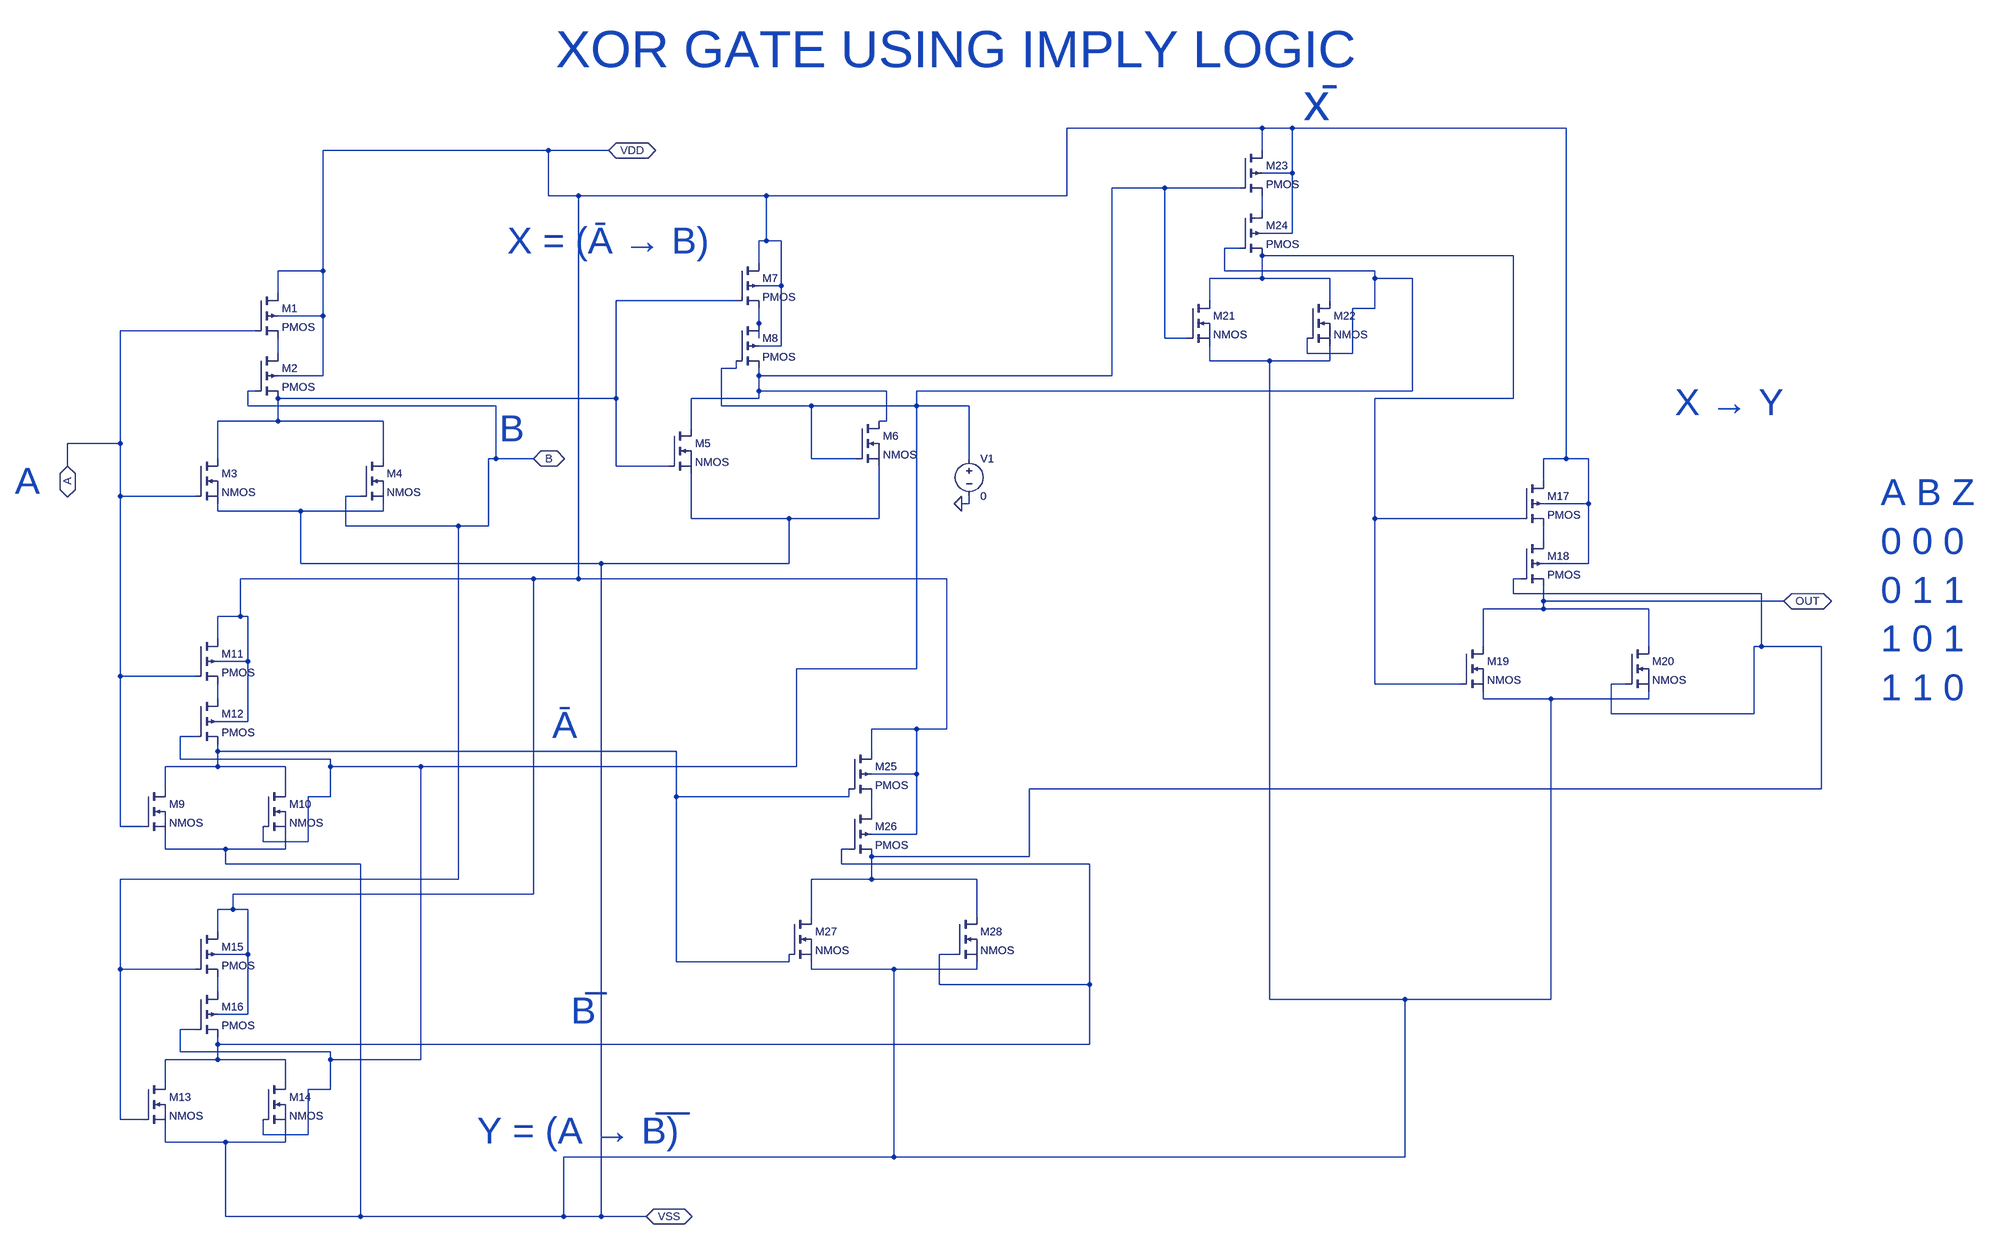
[diagram p0: schematic Xorimply.asc]
Xorimply.asc, the LTspice schematic file:
Version 4
SHEET 1 2252 1368
WIRE 672 -1056 256 -1056
WIRE 736 -1056 672 -1056
WIRE 1344 -1056 736 -1056
WIRE -848 -1008 -1328 -1008
WIRE -720 -1008 -848 -1008
WIRE 672 -1008 672 -1056
WIRE 736 -960 736 -1056
WIRE 736 -960 672 -960
WIRE 464 -928 352 -928
WIRE 624 -928 464 -928
WIRE -848 -912 -848 -1008
WIRE -784 -912 -848 -912
WIRE -384 -912 -784 -912
WIRE 256 -912 256 -1056
WIRE 256 -912 -384 -912
WIRE 672 -880 672 -912
WIRE 736 -832 736 -960
WIRE 736 -832 672 -832
WIRE -384 -816 -384 -912
WIRE -384 -816 -400 -816
WIRE -352 -816 -384 -816
WIRE 624 -800 592 -800
WIRE 1232 -784 672 -784
WIRE -400 -768 -400 -816
WIRE -1328 -752 -1328 -1008
WIRE -1328 -752 -1424 -752
WIRE 592 -752 592 -800
WIRE 912 -752 592 -752
WIRE 672 -736 672 -784
WIRE 672 -736 560 -736
WIRE 816 -736 672 -736
WIRE 912 -736 912 -752
WIRE 992 -736 912 -736
WIRE -352 -720 -352 -816
WIRE -352 -720 -400 -720
WIRE -1424 -704 -1424 -752
WIRE -448 -688 -704 -688
WIRE 560 -688 560 -736
WIRE 816 -688 816 -736
WIRE 912 -672 912 -736
WIRE 912 -672 864 -672
WIRE -1328 -656 -1328 -752
WIRE -1328 -656 -1424 -656
WIRE -400 -640 -400 -672
WIRE -1472 -624 -1760 -624
WIRE -400 -608 -400 -640
WIRE 464 -608 464 -928
WIRE 512 -608 464 -608
WIRE -352 -592 -352 -720
WIRE -352 -592 -400 -592
WIRE -1424 -576 -1424 -608
WIRE 768 -576 768 -608
WIRE 864 -576 864 -672
WIRE 864 -576 768 -576
WIRE 560 -560 560 -592
WIRE 688 -560 560 -560
WIRE 816 -560 816 -592
WIRE 816 -560 688 -560
WIRE -448 -544 -448 -560
WIRE -448 -544 -480 -544
WIRE -1328 -528 -1328 -656
WIRE -1328 -528 -1424 -528
WIRE -400 -528 -400 -544
WIRE 352 -528 352 -928
WIRE 352 -528 -400 -528
WIRE -1472 -496 -1488 -496
WIRE -400 -496 -400 -528
WIRE -128 -496 -400 -496
WIRE 992 -496 992 -736
WIRE 992 -496 -64 -496
WIRE -704 -480 -704 -688
WIRE -704 -480 -1424 -480
WIRE -400 -480 -400 -496
WIRE -400 -480 -544 -480
WIRE 1232 -480 1232 -784
WIRE 1232 -480 912 -480
WIRE -1488 -464 -1488 -496
WIRE -960 -464 -1488 -464
WIRE -480 -464 -480 -544
WIRE -288 -464 -480 -464
WIRE -64 -464 -64 -496
WIRE -64 -464 -288 -464
WIRE 48 -464 -64 -464
WIRE -1424 -432 -1424 -480
WIRE -1424 -432 -1552 -432
WIRE -1200 -432 -1424 -432
WIRE -128 -432 -128 -496
WIRE -128 -432 -144 -432
WIRE -544 -416 -544 -480
WIRE -1760 -384 -1760 -624
WIRE -1760 -384 -1872 -384
WIRE -1552 -352 -1552 -432
WIRE -1200 -352 -1200 -432
WIRE -960 -352 -960 -464
WIRE -960 -352 -976 -352
WIRE -880 -352 -960 -352
WIRE -288 -352 -288 -464
WIRE -192 -352 -288 -352
WIRE 48 -352 48 -464
WIRE 1344 -352 1344 -1056
WIRE 1344 -352 1296 -352
WIRE 1392 -352 1344 -352
WIRE -1872 -336 -1872 -384
WIRE -704 -336 -704 -480
WIRE -592 -336 -704 -336
WIRE 1296 -304 1296 -352
WIRE -1760 -272 -1760 -384
WIRE -1600 -272 -1760 -272
WIRE -1248 -272 -1280 -272
WIRE 48 -256 48 -272
WIRE 48 -256 32 -256
WIRE 1392 -256 1392 -352
WIRE 1392 -256 1296 -256
WIRE -1552 -240 -1552 -256
WIRE -1376 -240 -1552 -240
WIRE -1200 -240 -1200 -256
WIRE -1200 -240 -1376 -240
WIRE -544 -224 -544 -320
WIRE -336 -224 -544 -224
WIRE -144 -224 -144 -336
WIRE -144 -224 -336 -224
WIRE 912 -224 912 -480
WIRE 1248 -224 912 -224
WIRE -1280 -208 -1280 -272
WIRE -1040 -208 -1280 -208
WIRE -976 -208 -976 -352
WIRE -976 -208 -1040 -208
WIRE 1296 -176 1296 -208
WIRE -1376 -128 -1376 -240
WIRE -736 -128 -1376 -128
WIRE -336 -128 -336 -224
WIRE -336 -128 -736 -128
WIRE 1392 -128 1392 -256
WIRE 1392 -128 1296 -128
WIRE -880 -96 -1504 -96
WIRE -784 -96 -784 -912
WIRE -784 -96 -880 -96
WIRE 0 -96 -784 -96
WIRE 1248 -96 1232 -96
WIRE 1232 -64 1232 -96
WIRE 1760 -64 1232 -64
WIRE 1296 -48 1296 -80
WIRE 1808 -48 1296 -48
WIRE 1296 -32 1296 -48
WIRE 1296 -32 1168 -32
WIRE 1520 -32 1296 -32
WIRE -1504 -16 -1504 -96
WIRE -1504 -16 -1552 -16
WIRE -1488 -16 -1504 -16
WIRE -1552 32 -1552 -16
WIRE 1168 48 1168 -32
WIRE 1520 48 1520 -32
WIRE 1760 48 1760 -64
WIRE 1760 48 1744 48
WIRE 1888 48 1760 48
WIRE -1488 80 -1488 -16
WIRE -1488 80 -1552 80
WIRE -64 96 -64 -464
WIRE -64 96 -320 96
WIRE -1760 112 -1760 -272
WIRE -1600 112 -1760 112
WIRE 912 128 912 -224
WIRE 1120 128 912 128
WIRE 1472 128 1440 128
WIRE -1552 160 -1552 128
WIRE 1168 160 1168 144
WIRE 1312 160 1168 160
WIRE 1520 160 1520 144
WIRE 1520 160 1312 160
WIRE 1440 192 1440 128
WIRE 1744 192 1744 48
WIRE 1744 192 1440 192
WIRE -1488 208 -1488 80
WIRE -1488 208 -1552 208
WIRE -64 224 -160 224
WIRE 0 224 0 -96
WIRE 0 224 -64 224
WIRE -1600 240 -1632 240
WIRE -1552 272 -1552 256
WIRE -576 272 -1552 272
WIRE -160 272 -160 224
WIRE -1632 288 -1632 240
WIRE -1312 288 -1632 288
WIRE -1552 304 -1552 272
WIRE -1552 304 -1664 304
WIRE -1408 304 -1552 304
WIRE -1312 304 -1312 288
WIRE -1120 304 -1312 304
WIRE -320 304 -320 96
WIRE -320 304 -1120 304
WIRE -64 320 -64 224
WIRE -64 320 -160 320
WIRE -1664 352 -1664 304
WIRE -1408 352 -1408 304
WIRE 1888 352 1888 48
WIRE 1888 352 176 352
WIRE -1312 368 -1312 304
WIRE -1312 368 -1360 368
WIRE -576 368 -576 272
WIRE -208 368 -208 352
WIRE -208 368 -576 368
WIRE -160 400 -160 368
WIRE -1760 432 -1760 112
WIRE -1712 432 -1760 432
WIRE -64 448 -64 320
WIRE -64 448 -160 448
WIRE -1456 464 -1456 432
WIRE -1360 464 -1360 368
WIRE -1360 464 -1456 464
WIRE -1664 480 -1664 448
WIRE -1536 480 -1664 480
WIRE -1408 480 -1408 448
WIRE -1408 480 -1536 480
WIRE -208 480 -224 480
WIRE 176 496 176 352
WIRE 176 496 -160 496
WIRE -1536 512 -1536 480
WIRE -1248 512 -1536 512
WIRE -224 512 -224 480
WIRE 304 512 -224 512
WIRE -1040 544 -1040 -208
WIRE -1040 544 -1760 544
WIRE -160 544 -160 496
WIRE -160 544 -288 544
WIRE 64 544 -160 544
WIRE -880 576 -880 -96
WIRE -880 576 -1520 576
WIRE -1520 608 -1520 576
WIRE -1520 608 -1552 608
WIRE -1488 608 -1520 608
WIRE -288 624 -288 544
WIRE 64 624 64 544
WIRE -1552 656 -1552 608
WIRE -1488 704 -1488 608
WIRE -1488 704 -1552 704
WIRE 16 704 -16 704
WIRE -576 720 -576 368
WIRE -336 720 -336 704
WIRE -336 720 -576 720
WIRE -1760 736 -1760 544
WIRE -1600 736 -1760 736
WIRE -288 736 -288 720
WIRE -112 736 -288 736
WIRE 64 736 64 720
WIRE 64 736 -112 736
WIRE -16 768 -16 704
WIRE 304 768 304 512
WIRE 304 768 -16 768
WIRE -1552 784 -1552 752
WIRE 688 800 688 -560
WIRE 976 800 688 800
WIRE 1312 800 1312 160
WIRE 1312 800 976 800
WIRE -1488 832 -1488 704
WIRE -1488 832 -1552 832
WIRE -1600 864 -1632 864
WIRE -1552 896 -1552 880
WIRE 304 896 304 768
WIRE 304 896 -1552 896
WIRE -1632 912 -1632 864
WIRE -1312 912 -1632 912
WIRE -1552 928 -1552 896
WIRE -1552 928 -1664 928
WIRE -1408 928 -1552 928
WIRE -1312 928 -1312 912
WIRE -1120 928 -1120 304
WIRE -1120 928 -1312 928
WIRE -1664 976 -1664 928
WIRE -1408 976 -1408 928
WIRE -1312 992 -1312 928
WIRE -1312 992 -1360 992
WIRE -1760 1056 -1760 736
WIRE -1712 1056 -1760 1056
WIRE -1456 1088 -1456 1056
WIRE -1360 1088 -1360 992
WIRE -1360 1088 -1456 1088
WIRE -1664 1104 -1664 1072
WIRE -1536 1104 -1664 1104
WIRE -1408 1104 -1408 1072
WIRE -1408 1104 -1536 1104
WIRE -112 1136 -112 736
WIRE -112 1136 -816 1136
WIRE 976 1136 976 800
WIRE 976 1136 -112 1136
WIRE -1536 1296 -1536 1104
WIRE -1248 1296 -1248 512
WIRE -1248 1296 -1536 1296
WIRE -816 1296 -816 1136
WIRE -816 1296 -1248 1296
WIRE -736 1296 -736 -128
WIRE -736 1296 -816 1296
WIRE -640 1296 -736 1296
FLAG 32 -256 0
FLAG 1808 -48 OUT
IOPIN 1808 -48 BiDir
FLAG -1872 -336 A
IOPIN -1872 -336 BiDir
FLAG -880 -352 B
IOPIN -880 -352 BiDir
FLAG -720 -1008 VDD
IOPIN -720 -1008 BiDir
FLAG -640 1296 VSS
IOPIN -640 1296 BiDir
SYMBOL pmos4 -1472 -704 R0
SYMATTR InstName M1
SYMBOL pmos4 -1472 -576 R0
SYMATTR InstName M2
SYMBOL nmos -1600 -352 R0
SYMATTR InstName M3
SYMBOL nmos -1248 -352 R0
SYMATTR InstName M4
SYMBOL nmos -592 -416 R0
SYMATTR InstName M5
SYMBOL nmos -192 -432 R0
SYMATTR InstName M6
SYMBOL voltage 48 -368 R0
WINDOW 123 0 0 Left 0
WINDOW 39 0 0 Left 0
SYMATTR InstName V1
SYMATTR Value 0
SYMBOL pmos4 -448 -768 R0
SYMATTR InstName M7
SYMBOL pmos4 -448 -640 R0
SYMATTR InstName M8
SYMBOL nmos -1712 352 R0
SYMATTR InstName M9
SYMBOL nmos -1456 352 R0
SYMATTR InstName M10
SYMBOL pmos4 -1600 32 R0
SYMATTR InstName M11
SYMBOL pmos4 -1600 160 R0
SYMATTR InstName M12
SYMBOL nmos -1712 976 R0
SYMATTR InstName M13
SYMBOL nmos -1456 976 R0
SYMATTR InstName M14
SYMBOL pmos4 -1600 656 R0
SYMATTR InstName M15
SYMBOL pmos4 -1600 784 R0
SYMATTR InstName M16
SYMBOL pmos4 1248 -304 R0
SYMATTR InstName M17
SYMBOL pmos4 1248 -176 R0
SYMATTR InstName M18
SYMBOL nmos 1120 48 R0
SYMATTR InstName M19
SYMBOL nmos 1472 48 R0
SYMATTR InstName M20
SYMBOL nmos 512 -688 R0
SYMATTR InstName M21
SYMBOL nmos 768 -688 R0
SYMATTR InstName M22
SYMBOL pmos4 624 -1008 R0
SYMATTR InstName M23
SYMBOL pmos4 624 -880 R0
SYMATTR InstName M24
SYMBOL pmos4 -208 272 R0
SYMATTR InstName M25
SYMBOL pmos4 -208 400 R0
SYMATTR InstName M26
SYMBOL nmos -336 624 R0
SYMATTR InstName M27
SYMBOL nmos 16 624 R0
SYMATTR InstName M28
TEXT -936 -816 Left 6 ;X = (Ā → B)
TEXT -1984 -304 Left 6 ;A
TEXT -800 824 Left 6 ;B̅
TEXT -840 216 Left 6 ;Ā
TEXT -1000 1080 Left 6 ;Y = (A → B̅)̅
TEXT 760 -1112 Left 7 ;x̄
TEXT 1576 -472 Left 6 ;X → Y
TEXT -832 -1224 Left 7 ;XOR GATE USING IMPLY LOGIC
TEXT 2024 -280 Left 6 ;A B Z \n0 0 0\n0 1 1\n1 0 1\n1 1 0
TEXT -952 -416 Left 6 ;B

The netlist it stands for:
* Xorimply.asc
M1 VDD A N007 VDD PMOS
M2 N007 B N005 VDD PMOS
M3 N005 A VSS VSS NMOS
M4 N005 B VSS VSS NMOS
M5 N001 N005 VSS VSS NMOS
M6 N001 N003 VSS VSS NMOS
V1 N003 0 0
M7 VDD N005 N006 VDD PMOS
M8 N006 N003 N001 VDD PMOS
M9 N011 A VSS VSS NMOS
M10 N011 N003 VSS VSS NMOS
M11 VDD A N010 VDD PMOS
M12 N010 N003 N011 VDD PMOS
M13 N013 B VSS VSS NMOS
M14 N013 N003 VSS VSS NMOS
M15 VDD B N014 VDD PMOS
M16 N014 N003 N013 VDD PMOS
M17 VDD N004 N008 VDD PMOS
M18 N008 N009 OUT VDD PMOS
M19 OUT N004 VSS VSS NMOS
M20 OUT N009 VSS VSS NMOS
M21 N004 N001 VSS VSS NMOS
M22 N004 N003 VSS VSS NMOS
M23 VDD N001 N002 VDD PMOS
M24 N002 N003 N004 VDD PMOS
M25 VDD N011 N012 VDD PMOS
M26 N012 N013 N009 VDD PMOS
M27 N009 N011 VSS VSS NMOS
M28 N009 N013 VSS VSS NMOS
.model NMOS NMOS
.model PMOS PMOS
.lib standard.mos
* X = (Ā → B)
* A
* B̅
* Ā
* Y = (A → B̅)̅
* x̄
* X → Y
* XOR GATE USING IMPLY LOGIC
* A B Z
* 0 0 0
* 0 1 1
* 1 0 1
* 1 1 0
* B
.backanno
.end